# Altium project TD2_Espectrometro.PrjPcb
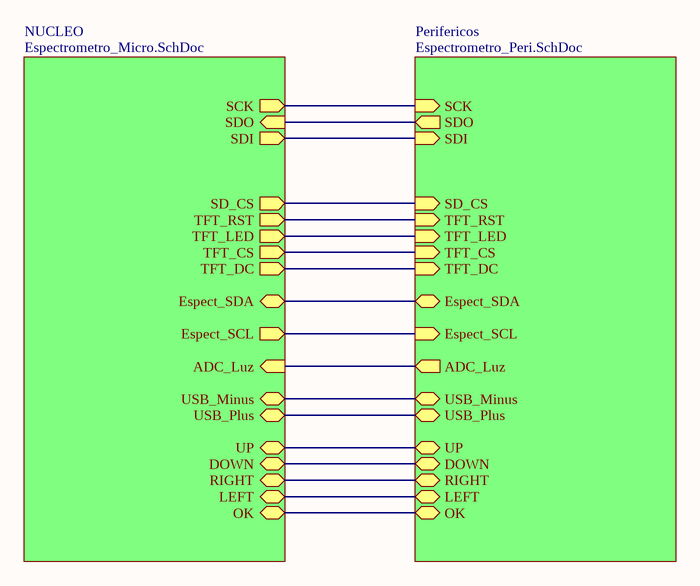
[diagram p0: Espectrometro_Bank.SchDoc]
3 sheets, 19 parts. Net scope: hierarchical (ports join the sheet entries above them; power ports are global).
Board files: Espectrometro_V2.PcbDoc, PCB1.PcbDoc
Sheets:
  Espectrometro_Bank.SchDoc
    NUCLEO = Espectrometro_Micro.SchDoc
    Perifericos = Espectrometro_Peri.SchDoc

## Sheet Espectrometro_Bank.SchDoc
size A4

### Sub-sheets
NUCLEO = Espectrometro_Micro.SchDoc: SCK (out), SDO (in), SDI (out), TFT_RST (out), TFT_LED (out), TFT_CS (out), SD_CS (out), Espect_SCL (out), ADC_Luz (in), Espect_SDA (bidir), TFT_DC (out), USB_Plus (bidir), USB_Minus (bidir), RIGHT (bidir), LEFT (bidir), DOWN (bidir), UP (bidir), OK (bidir)
Perifericos = Espectrometro_Peri.SchDoc: SCK (in), SDO (out), SDI (in), TFT_RST (in), TFT_LED (in), TFT_CS (in), SD_CS (in), Espect_SCL (in), Espect_SDA (bidir), ADC_Luz (out), TFT_DC (in), USB_Plus (bidir), USB_Minus (bidir), UP (bidir), DOWN (bidir), RIGHT (bidir), LEFT (bidir), OK (bidir)

### Nets
ADC_Luz: sheet NUCLEO/ADC_Luz, sheet Perifericos/ADC_Luz
DOWN: sheet NUCLEO/DOWN, sheet Perifericos/DOWN
Espect_SCL: sheet NUCLEO/Espect_SCL, sheet Perifericos/Espect_SCL
Espect_SDA: sheet NUCLEO/Espect_SDA, sheet Perifericos/Espect_SDA
LEFT: sheet NUCLEO/LEFT, sheet Perifericos/LEFT
OK: sheet NUCLEO/OK, sheet Perifericos/OK
RIGHT: sheet NUCLEO/RIGHT, sheet Perifericos/RIGHT
SCK: sheet NUCLEO/SCK, sheet Perifericos/SCK
SD_CS: sheet NUCLEO/SD_CS, sheet Perifericos/SD_CS
SDI: sheet NUCLEO/SDI, sheet Perifericos/SDI
SDO: sheet NUCLEO/SDO, sheet Perifericos/SDO
TFT_CS: sheet NUCLEO/TFT_CS, sheet Perifericos/TFT_CS
TFT_DC: sheet NUCLEO/TFT_DC, sheet Perifericos/TFT_DC
TFT_LED: sheet NUCLEO/TFT_LED, sheet Perifericos/TFT_LED
TFT_RST: sheet NUCLEO/TFT_RST, sheet Perifericos/TFT_RST
UP: sheet NUCLEO/UP, sheet Perifericos/UP
USB_Minus: sheet NUCLEO/USB_Minus, sheet Perifericos/USB_Minus
USB_Plus: sheet NUCLEO/USB_Plus, sheet Perifericos/USB_Plus

## Sheet Espectrometro_Micro.SchDoc
size A4
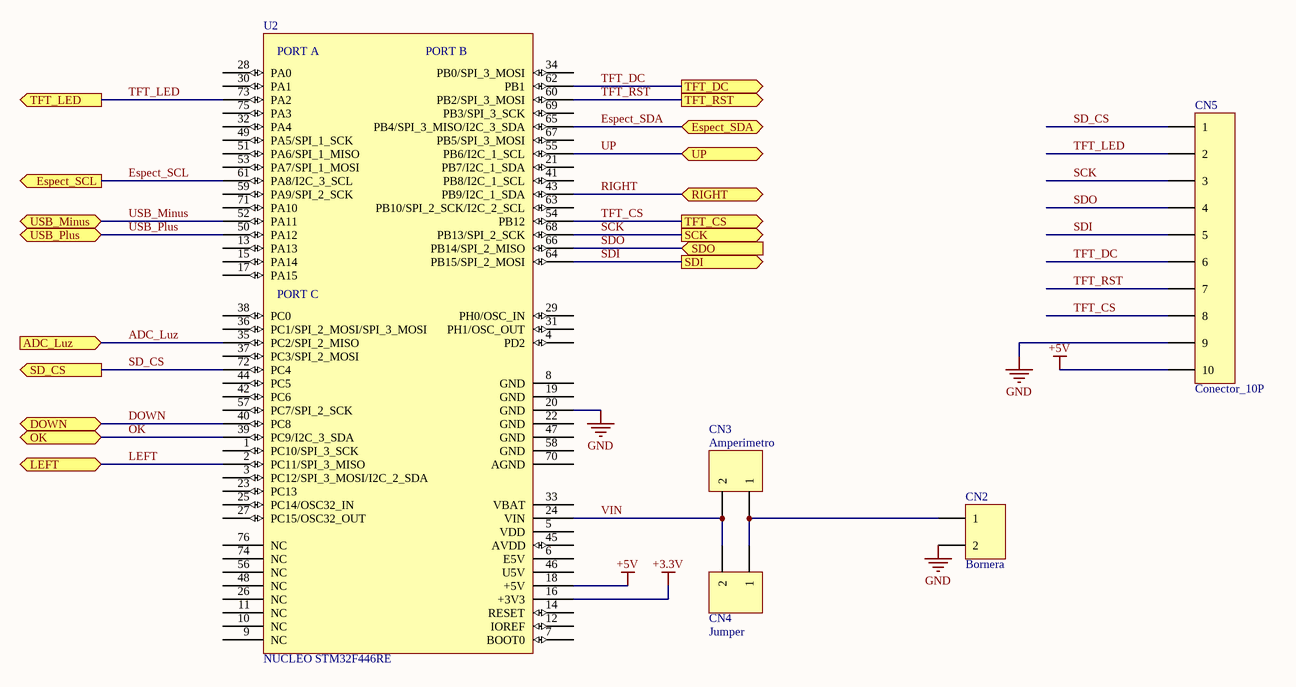
[diagram p1: Espectrometro_Micro.SchDoc]

### Parts
CN2  Bornera  [TERMINAL BLOCK DG306 - D5mm - 02P]
CN3  Amperimetro  [TERMINAL BLOCK DG306 - D5mm - 02P]
CN4  Jumper  [HEADER_M-2x1_0.1"_V]
CN5  Conector_10P  [HEADER_M-10x2_0.1"_V]
U2  NUCLEO STM32F446RE  [NUCLEO - STM32F446RE - UP]

### Ports
ADC_Luz (in), DOWN (bidir), Espect_SCL (out), Espect_SDA (bidir), LEFT (bidir), OK (bidir), RIGHT (bidir), SCK (out), SD_CS (out), SDI (out), SDO (in), TFT_CS (out), TFT_DC (out), TFT_LED (out), TFT_RST (out), UP (bidir), USB_Minus (bidir), USB_Plus (bidir)

### Nets
+3.3V: U2.16(+3V3)
+5V: CN5.10 U2.18(+5V)
GND: CN2.2 CN5.9 U2.20(GND)
ADC_Luz: U2.35(PC2/SPI_2_MISO) ; port ADC_Luz
DOWN: U2.40(PC8) ; port DOWN
Espect_SCL: U2.61(PA8/I2C_3_SCL) ; port Espect_SCL
Espect_SDA: U2.65(PB4/SPI_3_MISO/I2C_3_SDA) ; port Espect_SDA
LEFT: U2.2(PC11/SPI_3_MISO) ; port LEFT
OK: U2.39(PC9/I2C_3_SDA) ; port OK
RIGHT: U2.43(PB9/I2C_1_SDA) ; port RIGHT
SCK: CN5.3 U2.68(PB13/SPI_2_SCK) ; port SCK
SD_CS: CN5.1 U2.72(PC4) ; port SD_CS
SDI: CN5.5 U2.64(PB15/SPI_2_MOSI) ; port SDI
SDO: CN5.4 U2.66(PB14/SPI_2_MISO) ; port SDO
TFT_CS: CN5.8 U2.54(PB12) ; port TFT_CS
TFT_DC: CN5.6 U2.62(PB1) ; port TFT_DC
TFT_LED: CN5.2 U2.73(PA2) ; port TFT_LED
TFT_RST: CN5.7 U2.60(PB2/SPI_3_MOSI) ; port TFT_RST
UP: U2.55(PB6/I2C_1_SCL) ; port UP
USB_Minus: U2.52(PA11) ; port USB_Minus
USB_Plus: U2.50(PA12) ; port USB_Plus
VIN: CN3.2 CN4.2 U2.24(VIN)
NetCN2_1: CN2.1 CN3.1 CN4.1

Not connected (* = marked no-connect by the designer): U2 1(PC10/SPI_3_SCK) 3(PC12/SPI_3_MOSI/I2C_2_SDA) 4(PD2) 5(VDD) 6(E5V) 7(BOOT0) 8(GND) 9(NC) 10(NC) 11(NC) 12(IOREF) 13(PA13) 14(RESET) 15(PA14) 17(PA15) 19(GND) 21(PB7/I2C_1_SDA) 22(GND) 23(PC13) 25(PC14/OSC32_IN) 26(NC) 27(PC15/OSC32_OUT) 28(PA0) 29(PH0/OSC_IN) 30(PA1) 31(PH1/OSC_OUT) 32(PA4) 33(VBAT) 34(PB0/SPI_3_MOSI) 36(PC1/SPI_2_MOSI/SPI_3_MOSI) 37(PC3/SPI_2_MOSI) 38(PC0) 41(PB8/I2C_1_SCL) 42(PC6) 44(PC5) 45(AVDD) 46(U5V) 47(GND) 48(NC) 49(PA5/SPI_1_SCK) 51(PA6/SPI_1_MISO) 53(PA7/SPI_1_MOSI) 56(NC) 57(PC7/SPI_2_SCK) 58(GND) 59(PA9/SPI_2_SCK) 63(PB10/SPI_2_SCK/I2C_2_SCL) 67(PB5/SPI_3_MOSI) 69(PB3/SPI_3_SCK) 70(AGND) 71(PA10) 74(NC) 75(PA3) 76(NC)

### Notes on the sheet
- (in symbol NUCLEO STM32F446RE) PORT A; PORT B; PORT C

### Library data of the parts
CN2 = Conector_2P: Conector 2 Vias
CN3 = Conector_2P_Amp: Conector 2 Vias
CN4 = Conector_2P
CN5 = Conector_10P: Conector 10 Vias

## Sheet Espectrometro_Peri.SchDoc
size A4
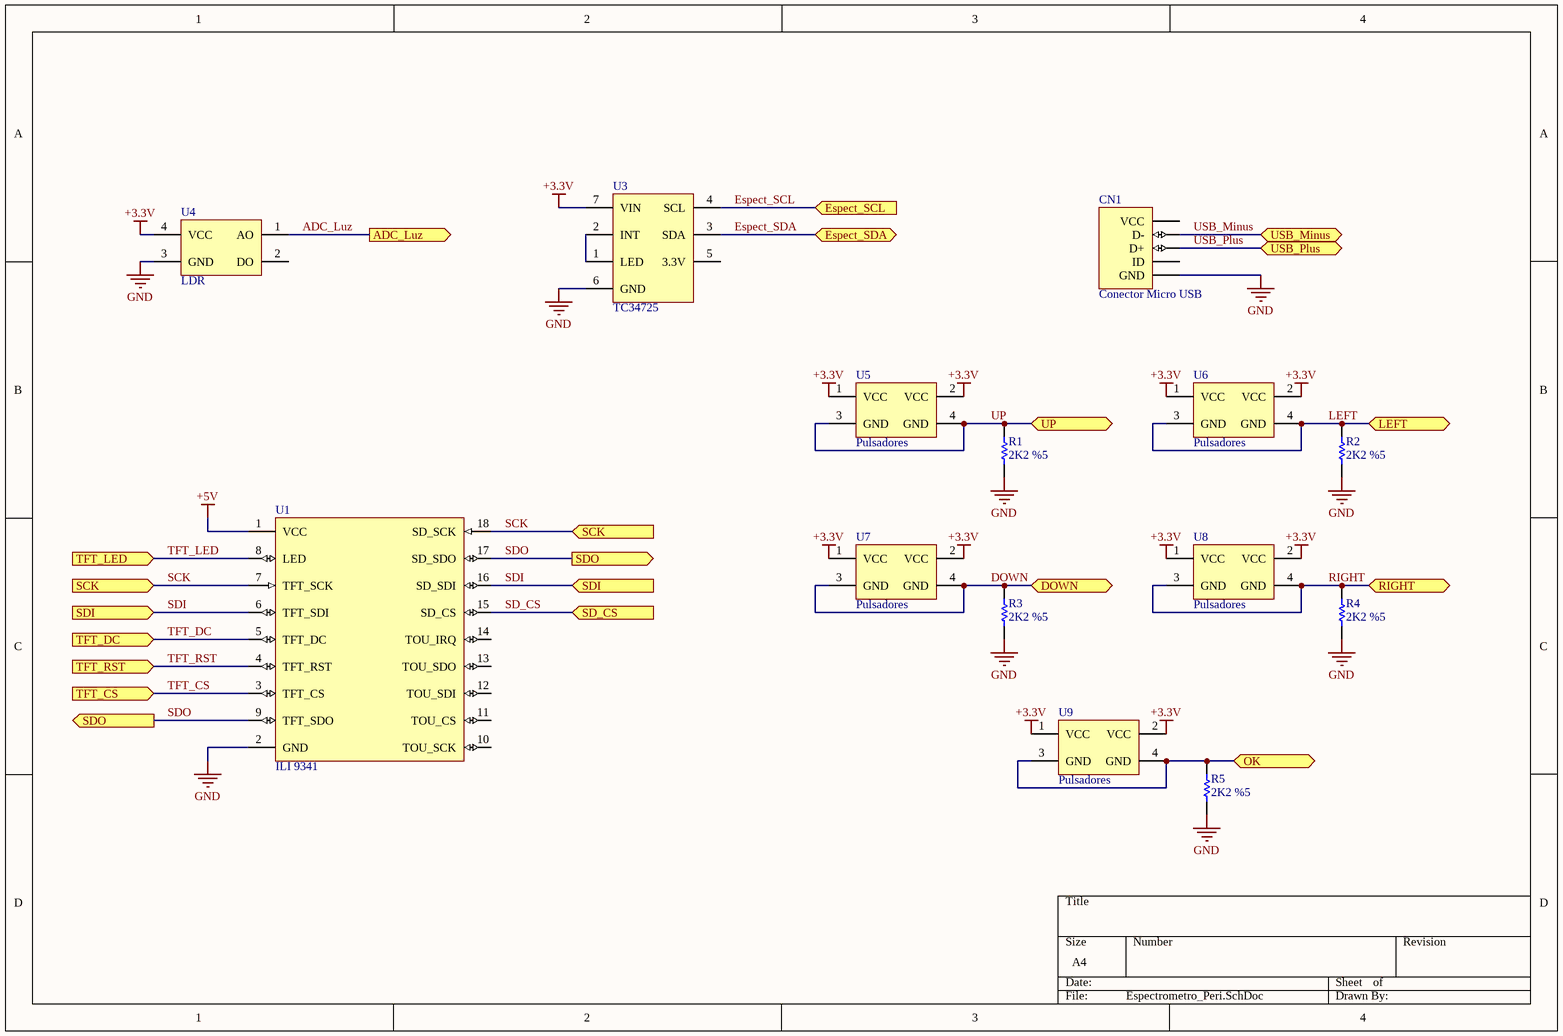
[diagram p2: Espectrometro_Peri.SchDoc]

### Parts
CN1  Conector Micro USB  [C8320-05BFRIB0R]
R1  2K2 %5  [R_400]
R2  2K2 %5  [R_400]
R3  2K2 %5  [R_400]
R4  2K2 %5  [R_400]
R5  2K2 %5  [R_400]
U1  ILI 9341  [Pantalla_TFT_2.4"]
U3  TC34725  [TC34725]
U4  LDR  [HEADER_M-4x1_0.1"_H]
U5  Pulsadores  [Tact Switch TH]
U6  Pulsadores  [Tact Switch TH]
U7  Pulsadores  [Tact Switch TH]
U8  Pulsadores  [Tact Switch TH]
U9  Pulsadores  [Tact Switch TH]

### Ports
ADC_Luz (out), DOWN (bidir), Espect_SCL (in), Espect_SDA (bidir), LEFT (bidir), OK (bidir), RIGHT (bidir), SCK (in), SD_CS (in), SDI (in), SDO (out), TFT_CS (in), TFT_DC (in), TFT_LED (in), TFT_RST (in), UP (bidir), USB_Minus (bidir), USB_Plus (bidir)

### Nets
+3.3V: U3.7(VIN) U4.4(VCC) U5.1(VCC) U5.2(VCC) U6.1(VCC) U6.2(VCC) U7.1(VCC) U7.2(VCC) U8.1(VCC) U8.2(VCC) U9.1(VCC) U9.2(VCC)
+5V: U1.1(VCC)
GND: CN1.5(GND) R1.2 R2.2 R3.2 R4.2 R5.2 U1.2(GND) U3.6(GND) U4.3(GND)
ADC_Luz: U4.1(AO) ; port ADC_Luz
DOWN: R3.1 U7.3(GND) U7.4(GND) ; port DOWN
Espect_SCL: U3.4(SCL) ; port Espect_SCL
Espect_SDA: U3.3(SDA) ; port Espect_SDA
LEFT: R2.1 U6.3(GND) U6.4(GND) ; port LEFT
OK: R5.1 U9.3(GND) U9.4(GND) ; port OK
RIGHT: R4.1 U8.3(GND) U8.4(GND) ; port RIGHT
SCK: U1.7(TFT_SCK) U1.18(SD_SCK) ; port SCK
SD_CS: U1.15(SD_CS) ; port SD_CS
SDI: U1.6(TFT_SDI) U1.16(SD_SDI) ; port SDI
SDO: U1.9(TFT_SDO) U1.17(SD_SDO) ; port SDO
TFT_CS: U1.3(TFT_CS) ; port TFT_CS
TFT_DC: U1.5(TFT_DC) ; port TFT_DC
TFT_LED: U1.8(LED) ; port TFT_LED
TFT_RST: U1.4(TFT_RST) ; port TFT_RST
UP: R1.1 U5.3(GND) U5.4(GND) ; port UP
USB_Minus: CN1.2(D-) ; port USB_Minus
USB_Plus: CN1.3(D+) ; port USB_Plus
NetU3_1: U3.1(LED) U3.2(INT)

Not connected (* = marked no-connect by the designer): CN1 1(VCC) 4(ID); U1 10(TOU_SCK) 11(TOU_CS) 12(TOU_SDI) 13(TOU_SDO) 14(TOU_IRQ); U3 5(3.3V); U4 2(DO)

### Library data of the parts
CN1 = Conector Micro USB: Conector Micro USB Type B
R1-R5 = Resistencia: Resistor; Footprint Version: v1.0; Packaging: *; Author: Franco Mendez
U1 = PantallaTFT: Pantalla TFT 2.4"
U3 = TC34725: Sensor RGB
U4 = LDR: Sensor LDR para medir Int.Luz
U5-U9 = Pulsadores: Tact Switch

## Nets that join several sheets
+3.3V: Espectrometro_Micro (U2.16), Espectrometro_Peri (12 pins)
+5V: Espectrometro_Micro (CN5.10 U2.18), Espectrometro_Peri (U1.1)
GND: Espectrometro_Micro (CN2.2 CN5.9 U2.20), Espectrometro_Peri (9 pins)
ADC_Luz: Espectrometro_Micro (U2.35), Espectrometro_Peri (U4.1)
DOWN: Espectrometro_Micro (U2.40), Espectrometro_Peri (R3.1 U7.3 U7.4)
Espect_SCL: Espectrometro_Micro (U2.61), Espectrometro_Peri (U3.4)
Espect_SDA: Espectrometro_Micro (U2.65), Espectrometro_Peri (U3.3)
LEFT: Espectrometro_Micro (U2.2), Espectrometro_Peri (R2.1 U6.3 U6.4)
OK: Espectrometro_Micro (U2.39), Espectrometro_Peri (R5.1 U9.3 U9.4)
RIGHT: Espectrometro_Micro (U2.43), Espectrometro_Peri (R4.1 U8.3 U8.4)
SCK: Espectrometro_Micro (CN5.3 U2.68), Espectrometro_Peri (U1.7 U1.18)
SD_CS: Espectrometro_Micro (CN5.1 U2.72), Espectrometro_Peri (U1.15)
SDI: Espectrometro_Micro (CN5.5 U2.64), Espectrometro_Peri (U1.6 U1.16)
SDO: Espectrometro_Micro (CN5.4 U2.66), Espectrometro_Peri (U1.9 U1.17)
TFT_CS: Espectrometro_Micro (CN5.8 U2.54), Espectrometro_Peri (U1.3)
TFT_DC: Espectrometro_Micro (CN5.6 U2.62), Espectrometro_Peri (U1.5)
TFT_LED: Espectrometro_Micro (CN5.2 U2.73), Espectrometro_Peri (U1.8)
TFT_RST: Espectrometro_Micro (CN5.7 U2.60), Espectrometro_Peri (U1.4)
UP: Espectrometro_Micro (U2.55), Espectrometro_Peri (R1.1 U5.3 U5.4)
USB_Minus: Espectrometro_Micro (U2.52), Espectrometro_Peri (CN1.2)
USB_Plus: Espectrometro_Micro (U2.50), Espectrometro_Peri (CN1.3)